# Altium project volume-adjuster-v1.0.PrjPcb
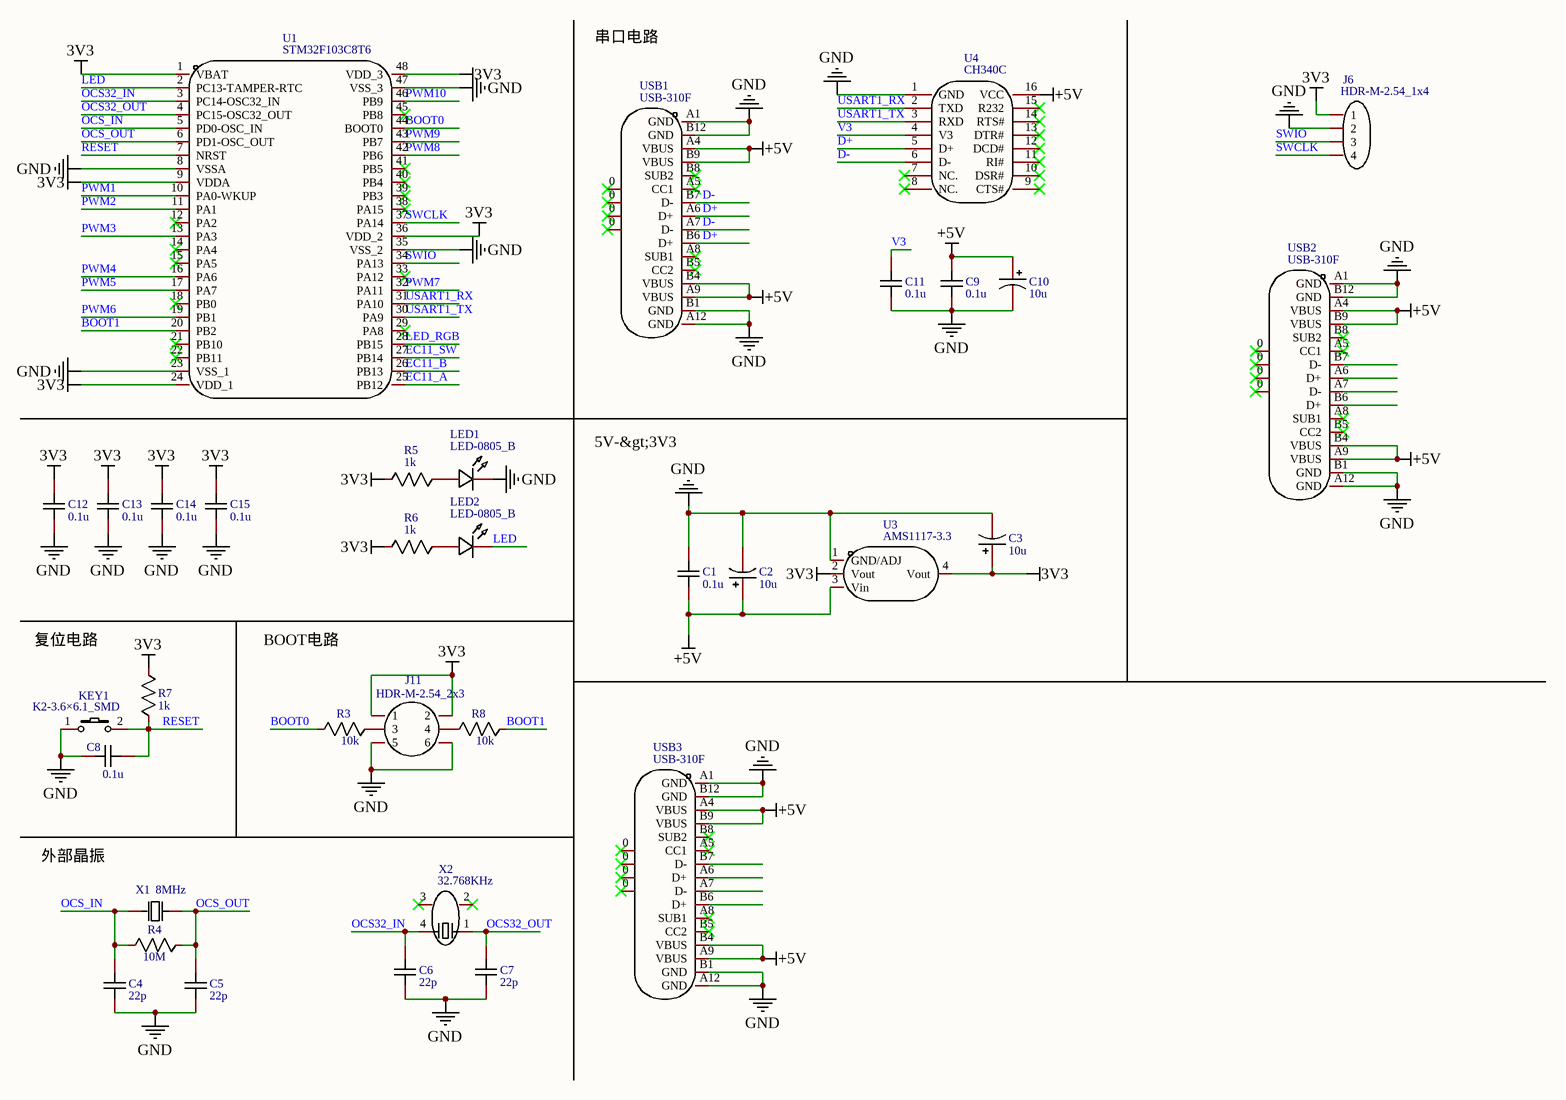
[diagram p0: STM32F103C8-core.schdoc]
2 sheets, 60 parts. Net scope: global (net labels, ports and power ports of the same name join across sheets).
Board file: PCB_volume-adjuster.pcbdoc
Sheets:
  STM32F103C8-core.schdoc
  external-circuit.SchDoc

## Sheet STM32F103C8-core.schdoc
size 497 x 243 mm; Name: A_A4; Symbol: A_A4; Device: A_A4; @Project Name: volume-adjuster-v1.0; REV: 1.0; Date: 2023-04-22; Sheet: 1/1; Draw By: wfei &amp; zzc; Company: 眼镜蛇小队; Convert to PCB: yes; Add into BOM: yes; SheetNumber: 1; SheetTotal: 2

### Parts
C1  0.1u  [C0805]
C2  10u  [CASE-A_3216]
C3  10u  [CASE-A_3216]
C4  22p  [C0805]
C5  22p  [C0805]
C6  22p  [C0805]
C7  22p  [C0805]
C8  0.1u  [C0805]
C9  0.1u  [C0805]
C10  10u  [CASE-A_3216]
C11  0.1u  [C0805]
C12  0.1u  [C0805]
C13  0.1u  [C0805]
C14  0.1u  [C0805]
C15  0.1u  [C0805]
J6  HDR-M-2.54_1x4  [HDR-M-2.54_1X4]
J11  HDR-M-2.54_2x3  [HDR-M-2.54_2X3]
KEY1  K2-3.6×6.1_SMD  [KEY-SMD_2P-L6.2-W3.6-LS8.0]
LED1  LED-0805_B  [LED0805_BLUE]
LED2  LED-0805_B  [LED0805_BLUE]
R3  10k  [R0805]
R4  10M  [R0805]
R5  1k  [R0805]
R6  1k  [R0805]
R7  1k  [R0805]
R8  10k  [R0805]
U1  STM32F103C8T6  [LQFP-48_L7.0-W7.0-P0.50-LS9.0-BL]
U3  AMS1117-3.3  [SOT-223-3_L6.5-W3.4-P2.30-LS7.0-BR]
U4  CH340C  [SOP-16_L10.0-W3.9-P1.27-LS6.0-BL]
USB1  USB-310F  [USB-C-SMD_20P-P0.50-L6.5-W8.9]
USB2  USB-310F  [USB-C-SMD_20P-P0.50-L6.5-W8.9]
USB3  USB-310F  [USB-C-SMD_20P-P0.50-L6.5-W8.9]
X1  8MHz  [OSC-TH_L11.1-W4.7-P4.88]
X2  32.768KHz  [MC-306_4P-L8.0-W3.2-P5.5-BL]

### Nets
3V3: C3.1 C12.2 C13.2 C14.2 C15.2 J6.1 J11.1 J11.2 R5.1 R6.1 R7.2 U1.1(VBAT) U1.9(VDDA) U1.24(VDD_1) U1.36(VDD_2) U1.48(VDD_3) U3.2(Vout) U3.4(Vout)
+5V: C1.1 C2.1 C9.2 C10.1 U3.3(Vin) U4.16(VCC) USB1.A4(VBUS) USB1.A9(VBUS) USB1.B4(VBUS) USB1.B9(VBUS) USB2.A4(VBUS) USB2.A9(VBUS) USB2.B4(VBUS) USB2.B9(VBUS) USB3.A4(VBUS) USB3.A9(VBUS) USB3.B4(VBUS) USB3.B9(VBUS)
GND: C1.2 C2.2 C3.2 C4.1 C5.1 C6.1 C7.1 C8.2 C9.1 C10.2 C11.1 C12.1 C13.1 C14.1 C15.1 J6.2 J11.5 J11.6 KEY1.1 LED1.2 U1.8(VSSA) U1.23(VSS_1) U1.35(VSS_2) U1.47(VSS_3) U3.1(GND/ADJ) U4.1(GND) USB1.A1(GND) USB1.A12(GND) USB1.B1(GND) USB1.B12(GND) USB2.A1(GND) USB2.A12(GND) USB2.B1(GND) USB2.B12(GND) USB3.A1(GND) USB3.A12(GND) USB3.B1(GND) USB3.B12(GND)
BOOT0: R3.1 U1.44(BOOT0)
BOOT1: R8.2 U1.20(PB2)
D+: U4.5(D+) USB1.A6(D+) USB1.B6(D+)
D-: U4.6(D-) USB1.A7(D-) USB1.B7(D-)
EC11_A: U1.25(PB12)
EC11_B: U1.26(PB13)
EC11_SW: U1.27(PB14)
LED: LED2.2 U1.2(PC13-TAMPER-RTC)
LED_RGB: U1.28(PB15)
OCS32_IN: C6.2 U1.3(PC14-OSC32_IN) X2.4
OCS32_OUT: C7.2 U1.4(PC15-OSC32_OUT) X2.1
OCS_IN: C4.2 R4.1 U1.5(PD0-OSC_IN) X1.1(OSC1)
OCS_OUT: C5.2 R4.2 U1.6(PD1-OSC_OUT) X1.2(OSC2)
PWM1: U1.10(PA0-WKUP)
PWM2: U1.11(PA1)
PWM3: U1.13(PA3)
PWM4: U1.16(PA6)
PWM5: U1.17(PA7)
PWM6: U1.19(PB1)
PWM7: U1.32(PA11)
PWM8: U1.42(PB6)
PWM9: U1.43(PB7)
PWM10: U1.46(PB9)
RESET: C8.1 KEY1.2 R7.1 U1.7(NRST)
SWCLK: J6.4 U1.37(PA14)
SWIO: J6.3 U1.34(PA13)
USART1_RX: U1.31(PA10) U4.2(TXD)
USART1_TX: U1.30(PA9) U4.3(RXD)
V3: C11.2 U4.4(V3)
NetJ11_3: J11.3 R3.2
NetJ11_4: J11.4 R8.1
NetLED1_1: LED1.1 R5.2
NetLED2_1: LED2.1 R6.2

Not connected (* = marked no-connect by the designer): U1 12(PA2)* 14(PA4)* 15(PA5)* 18(PB0)* 21(PB10)* 22(PB11)* 29(PA8)* 33(PA12)* 38(PA15)* 39(PB3)* 40(PB4)* 41(PB5)* 45(PB8)*; U4 7(NC.)* 8(NC.)* 9(CTS#)* 10(DSR#)* 11(RI#)* 12(DCD#)* 13(DTR#)* 14(RTS#)* 15(R232)*; USB1 0* A5(CC1)* A8(SUB1)* B5(CC2)* B8(SUB2)*; USB2 0* A5(CC1)* A6(D+) A7(D-) A8(SUB1)* B5(CC2)* B6(D+) B7(D-) B8(SUB2)*; USB3 0* A5(CC1)* A6(D+) A7(D-) A8(SUB1)* B5(CC2)* B6(D+) B7(D-) B8(SUB2)*; X2 2* 3*

### Notes on the sheet
- 串口电路
- 5V-&gt;3V3
- 复位电路
- BOOT电路
- 外部晶振
- 1
- 2
- 3
- 4
- 5
- A
- B
- C
- D
- TITLE:
- volume-adjuster-v1.0
- REV:
- 1.0
- Date:
- Company:
- 2023-04-22
- 眼镜蛇小队
- Drawn By:
- wfei &amp; zzc
- Sheet:
- 1/1

### Library data of the parts
C1 C8 C9 C11-C15 = 0.1u: Convert to PCB: yes; Name: 0.1u; Symbol: 0.1u; Device: 0.1u; Add into BOM: yes; Origin Footprint: C0805
C2 C3 C10 = 10u: Convert to PCB: yes; Name: 10u; Symbol: 10u; Device: 10u; Add into BOM: yes; Origin Footprint: CASE-A_3216
C4-C7 = 22p: Convert to PCB: yes; Name: 22p; Symbol: 22p; Device: 22p; Add into BOM: yes; Origin Footprint: C0805
J6 = HDR-M-2.54_1x4: Convert to PCB: yes; Name: HDR-M-2.54_1x4; Symbol: HDR-M-2.54_1x4; Device: HDR-M-2.54_1x4; Supplier Part: C124378; Supplier: LCSC; Add into BOM: yes; Origin Footprint: HDR-M-2.54_1X4
J11 = HDR-M-2.54_2x3: Convert to PCB: yes; Name: HDR-M-2.54_2x3; Symbol: HDR-M-2.54_2x3; Device: HDR-M-2.54_2x3; Supplier Part: C65114; Supplier: LCSC; Add into BOM: yes; Origin Footprint: HDR-M-2.54_2X3
KEY1 = K2-1107ST-A4SW-06: 制造商: 韩国韩荣; Convert to PCB: yes; Name: K2-3.6×6.1_SMD; Symbol: K2-3.6×6.1_SMD; Device: K2-1107ST-A4SW-06; Supplier Part: C118141; Supplier: LCSC; Manufacturer Part: K2-1107ST-A4SW-06; Add into BOM: yes; Origin Footprint: KEY-SMD_2P-L6.2-W3.6-LS8.0
LED1 LED2 = D-B080508B1-KS2: Manufacturer: 方舟 ARKLED; Convert to PCB: yes; Name: LED-0805_B; Symbol: LED-0805_B; Device: D-B080508B1-KS2; Manufacturer Part: D-B080508B1-KS2; Supplier Part: C108412; Add into BOM: yes; Origin Footprint: LED0805_BLUE
R3 R8 = 10k: Convert to PCB: yes; Name: 10k; Symbol: 10k; Device: 10k; Add into BOM: yes; Origin Footprint: R0805
R4 = 10M: Convert to PCB: yes; Name: 10M; Symbol: 10M; Device: 10M; Add into BOM: yes; Origin Footprint: R0805
R5-R7 = 1k: Convert to PCB: yes; Name: 1k; Symbol: 1k; Device: 1k; Add into BOM: yes; Origin Footprint: R0805
U1 = STM32F103C8T6: Manufacturer: STMicroelectronics; Convert to PCB: yes; Name: STM32F103C8T6; Symbol: STM32F103C8T6; Device: STM32F103C8T6; Supplier: LCSC; Manufacturer Part: STM32F103C8T6; image: //image.lceda.cn/szlcsc/C8734.jpg; Supplier Part: C8734; JLCPCB Part Class: Basic; Add into BOM: yes; Origin Footprint: LQFP-48_L7.0-W7.0-P0.50-LS9.0-BL
U3 = AMS1117-3.3: Manufacturer: AMS; Convert to PCB: yes; Name: AMS1117-3.3; Symbol: AMS1117-3.3; Device: AMS1117-3.3; Supplier: LCSC; Manufacturer Part: AMS1117-3.3; image: //image.lceda.cn/szlcsc/C6186.jpg; Supplier Part: C6186; JLCPCB Part Class: Basic; Add into BOM: yes; Origin Footprint: SOT-223-3_L6.5-W3.4-P2.30-LS7.0-BR
U4 = CH340C: Manufacturer: WCH; Convert to PCB: yes; Name: CH340C; Symbol: CH340C; Device: CH340C; Supplier: LCSC; Manufacturer Part: CH340C; Supplier Part: C84681; JLCPCB Part Class: Extend; Add into BOM: yes; Origin Footprint: SOP-16_L10.0-W3.9-P1.27-LS6.0-BL
USB1-USB3 = USB-310F: Manufacturer: HOOYA; Convert to PCB: yes; Name: USB-310F; Symbol: USB-310F; Device: USB-310F; Supplier: LCSC; Supplier Part: C309365; Manufacturer Part: USB-310F; Add into BOM: yes; Origin Footprint: USB-C-SMD_20P-P0.50-L6.5-W8.9
X1 = S1C80000VWGAC: 频率:8MHz;频率公差:±20ppm;频率稳定度:±30ppm;负载电容:16pF;; Manufacturer: JYJE(晶友嘉); Add into BOM: yes; Crystal Type: 直插无源晶振; Frequency Tolerance: ±20ppm; Frequency Stability: ±30ppm; Load Capacitance: 16pF; Equivalent Series Resistance (ESR): 60Ω; Name: 8MHz; Symbol: S1C80000VWGAC; Device: S1C80000VWGAC; LCSC Part Name: 8MHz ±20ppm 内置负载电容:16pF; Supplier Part: C2826849; Manufacturer Part: S1C80000VWGAC; Supplier Footprint: HC-49S; JLCPCB Part Class: Extended Part; Datasheet: https://atta.szlcsc.com/upload/public/pdf/source/20210114/C2149361_EC5FF9631B356CE93CF7A73B2F67D17A.pdf; Supplier: LCSC; Convert to PCB: yes; Value: 8MHz; Operating Temperature: -40℃~+85℃
X2 = Q13MC3061000300: Manufacturer: EPSON; Convert to PCB: yes; Name: 32.768KHz; Symbol: 32.768KHz; Device: Q13MC3061000300; Supplier: LCSC; Manufacturer Part: Q13MC3061000300; Supplier Part: C16320; JLCPCB Part Class: Extend; Add into BOM: yes; Origin Footprint: MC-306_4P-L8.0-W3.2-P5.5-BL

## Sheet external-circuit.SchDoc
size 497 x 243 mm; Name: A_A4; Symbol: A_A4; Device: A_A4; @Project Name: volume-adjuster-v1.0; REV: 1.0; Date: 2023-04-22; Sheet: 1/1; Draw By: wfei &amp; zzc; Company: Your Company; Convert to PCB: yes; Add into BOM: yes; SheetNumber: 2; SheetTotal: 1
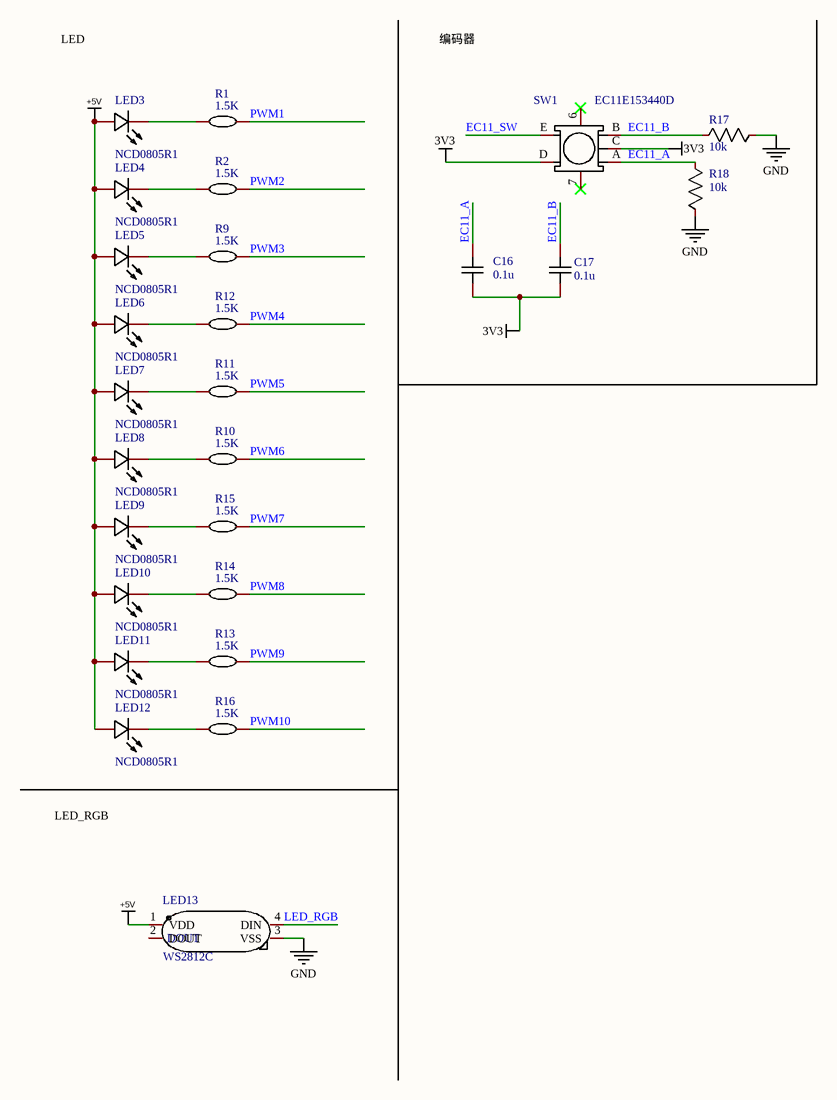
[diagram p1: external-circuit.SchDoc]

### Parts
C16  0.1u  [C0805]
C17  0.1u  [C0805]
LED3  NCD0805R1  [LED0805-RD_RED]
LED4  NCD0805R1  [LED0805-RD_RED]
LED5  NCD0805R1  [LED0805-RD_RED]
LED6  NCD0805R1  [LED0805-RD_RED]
LED7  NCD0805R1  [LED0805-RD_RED]
LED8  NCD0805R1  [LED0805-RD_RED]
LED9  NCD0805R1  [LED0805-RD_RED]
LED10  NCD0805R1  [LED0805-RD_RED]
LED11  NCD0805R1  [LED0805-RD_RED]
LED12  NCD0805R1  [LED0805-RD_RED]
LED13  NAME: DOUT  [LED-SMD_4P-L5.0-W5.0-LS5.4-TL-1]  (hidden comment: WS2812C)
R1  1.5K  [R0805]
R2  1.5K  [R0805]
R9  1.5K  [R0805]
R10  1.5K  [R0805]
R11  1.5K  [R0805]
R12  1.5K  [R0805]
R13  1.5K  [R0805]
R14  1.5K  [R0805]
R15  1.5K  [R0805]
R16  1.5K  [R0805]
R17  10k  [R0805]
R18  10k  [R0805]
SW1  EC11E153440D  [SW-TH_EC11XXXXXXXX]

### Nets
3V3: C16.1 C17.1 SW1.C SW1.D
+5V: LED3.2(+) LED4.2(+) LED5.2(+) LED6.2(+) LED7.2(+) LED8.2(+) LED9.2(+) LED10.2(+) LED11.2(+) LED12.2(+) LED13.1(VDD)
GND: LED13.3(VSS) R17.1 R18.2
EC11_A: C16.2 R18.1 SW1.A
EC11_B: C17.2 R17.2 SW1.B
EC11_SW: SW1.E
LED_RGB: LED13.4(DIN)
PWM1: R1.2
PWM2: R2.2
PWM3: R9.2
PWM4: R12.2
PWM5: R11.2
PWM6: R10.2
PWM7: R15.2
PWM8: R14.2
PWM9: R13.2
PWM10: R16.2
NetLED3_1: LED3.1(-) R1.1
NetLED4_1: LED4.1(-) R2.1
NetLED5_1: LED5.1(-) R9.1
NetLED6_1: LED6.1(-) R12.1
NetLED7_1: LED7.1(-) R11.1
NetLED8_1: LED8.1(-) R10.1
NetLED9_1: LED9.1(-) R15.1
NetLED10_1: LED10.1(-) R14.1
NetLED11_1: LED11.1(-) R13.1
NetLED12_1: LED12.1(-) R16.1

Not connected (* = marked no-connect by the designer): LED13 2(DOUT); SW1 6* 7*

### Notes on the sheet
- LED
- 编码器
- LED_RGB
- 1
- 2
- 3
- 4
- 5
- A
- B
- C
- D
- TITLE:
- volume-adjuster-v1.0
- REV:
- 1.0
- Date:
- Company:
- 2023-04-22
- Your Company
- Drawn By:
- wfei &amp; zzc
- Sheet:
- 1/1

### Library data of the parts
C16 C17 = 0.1u: Convert to PCB: yes; Name: 0.1u; Symbol: 0.1u; Device: 0.1u; Add into BOM: yes; Origin Footprint: C0805
LED3-LED12 = NCD0805R1: 发光颜色:红灯;; Manufacturer: 国星光电; Symbol: FC-2012HRK-620D; Add into BOM: yes; Emitted Color: 红灯; Name: NCD0805R1; Device: NCD0805R1; LCSC Part Name: 红灯; Supplier Part: C84256; Manufacturer Part: NCD0805R1; Supplier Footprint: 0805; JLCPCB Part Class: Basic Part; Datasheet: https://atta.szlcsc.com/upload/public/pdf/source/20200820/C84256_F0A75A43B3EAD75808600A0514C76B99.pdf; Supplier: LCSC; Convert to PCB: yes
LED13 = WS2812C: 发光颜色:RGB三色;; Manufacturer: worldsemi; Add into BOM: yes; Emitted Color: RGB三色; Name: WS2812C; Symbol: WS2812C; Device: WS2812C; LCSC Part Name: RGB三色 （注意防潮，请查阅规格书中对应具体内容）; Supplier Part: C114587; Manufacturer Part: WS2812C; Supplier Footprint: SMD5050; JLCPCB Part Class: Extended Part; Datasheet: https://atta.szlcsc.com/upload/public/pdf/source/20171019/C114587_15083980074721044737.pdf; Supplier: LCSC; Convert to PCB: yes
R1 R2 R9-R16 = AC0805FR-071K5L: Manufacturer: YAGEO(国巨); Resistance: 1.5kΩ; Convert to PCB: yes; Name: 1.5K; Symbol: 1.5K; Device: AC0805FR-071K5L; Supplier: LCSC; Supplier Part: C144580; Manufacturer Part: AC0805FR-071K5L; JLCPCB Part Class: Extended Part; Add into BOM: yes; Origin Footprint: R0805
R17 R18 = 10k: Convert to PCB: yes; Name: 10k; Symbol: 10k; Device: 10k; Add into BOM: yes; Origin Footprint: R0805
SW1 = EC11E153440D: Manufacturer: ALPSALPINE(阿尔卑斯阿尔派); Add into BOM: yes; Name: EC11E153440D; Symbol: EC11E153440D; Device: EC11E153440D; LCSC Part Name: 编码器; Supplier Part: C370992; Manufacturer Part: EC11E153440D; Supplier Footprint: 插件; JLCPCB Part Class: Extended Part; Datasheet: https://atta.szlcsc.com/upload/public/pdf/source/20200526/C370992_95C13CAE7E7FAF27485295BD459A5993.pdf; Supplier: LCSC; Convert to PCB: yes

## Nets that join several sheets
3V3: STM32F103C8-core (18 pins), external-circuit (C16.1 C17.1 SW1.C SW1.D)
+5V: STM32F103C8-core (18 pins), external-circuit (11 pins)
GND: STM32F103C8-core (38 pins), external-circuit (LED13.3 R17.1 R18.2)
EC11_A: STM32F103C8-core (U1.25), external-circuit (C16.2 R18.1 SW1.A)
EC11_B: STM32F103C8-core (U1.26), external-circuit (C17.2 R17.2 SW1.B)
EC11_SW: STM32F103C8-core (U1.27), external-circuit (SW1.E)
LED_RGB: STM32F103C8-core (U1.28), external-circuit (LED13.4)
PWM1: STM32F103C8-core (U1.10), external-circuit (R1.2)
PWM2: STM32F103C8-core (U1.11), external-circuit (R2.2)
PWM3: STM32F103C8-core (U1.13), external-circuit (R9.2)
PWM4: STM32F103C8-core (U1.16), external-circuit (R12.2)
PWM5: STM32F103C8-core (U1.17), external-circuit (R11.2)
PWM6: STM32F103C8-core (U1.19), external-circuit (R10.2)
PWM7: STM32F103C8-core (U1.32), external-circuit (R15.2)
PWM8: STM32F103C8-core (U1.42), external-circuit (R14.2)
PWM9: STM32F103C8-core (U1.43), external-circuit (R13.2)
PWM10: STM32F103C8-core (U1.46), external-circuit (R16.2)